# EasyEDA schematic SeniorDesignV2.json

## Sheets
1 LogicSch: TITLE: Logic; REV: 1.0; Date: 2020-09-24; Sheet: 1/1; Company: Owen Busler
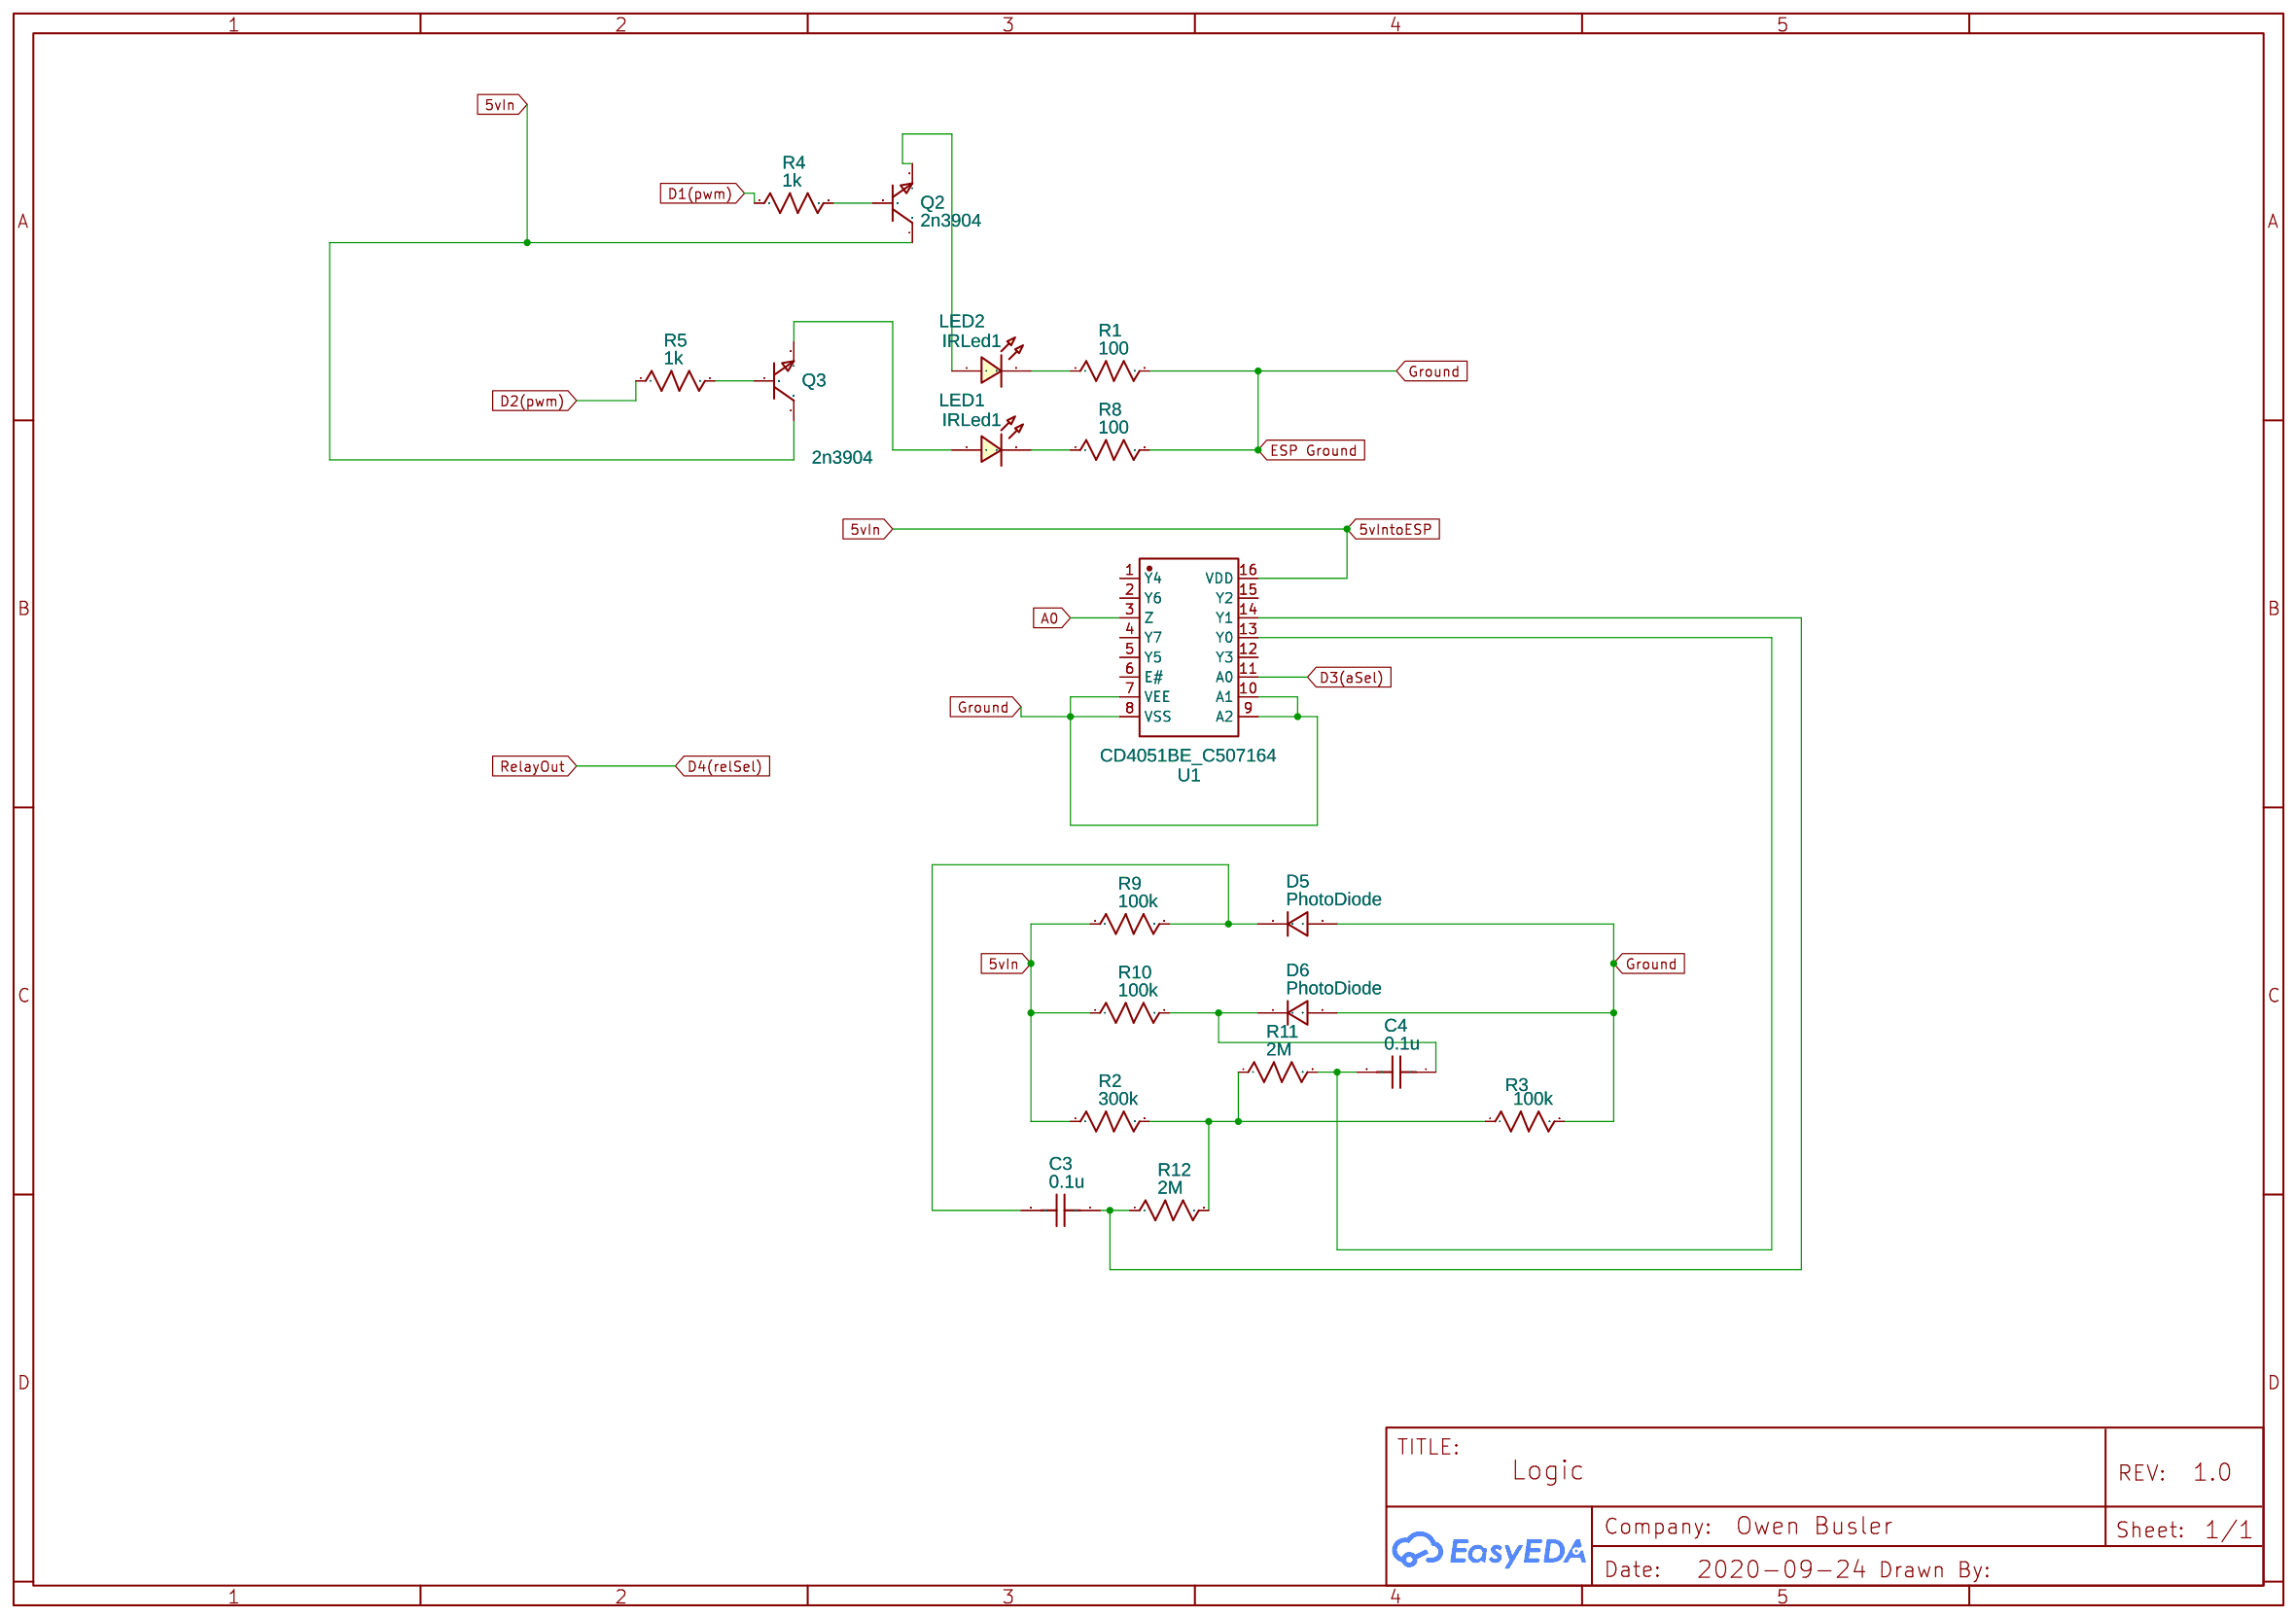
[diagram p0: LogicSch]
2 PowerSch: TITLE: PowerSch; Company: Your Company
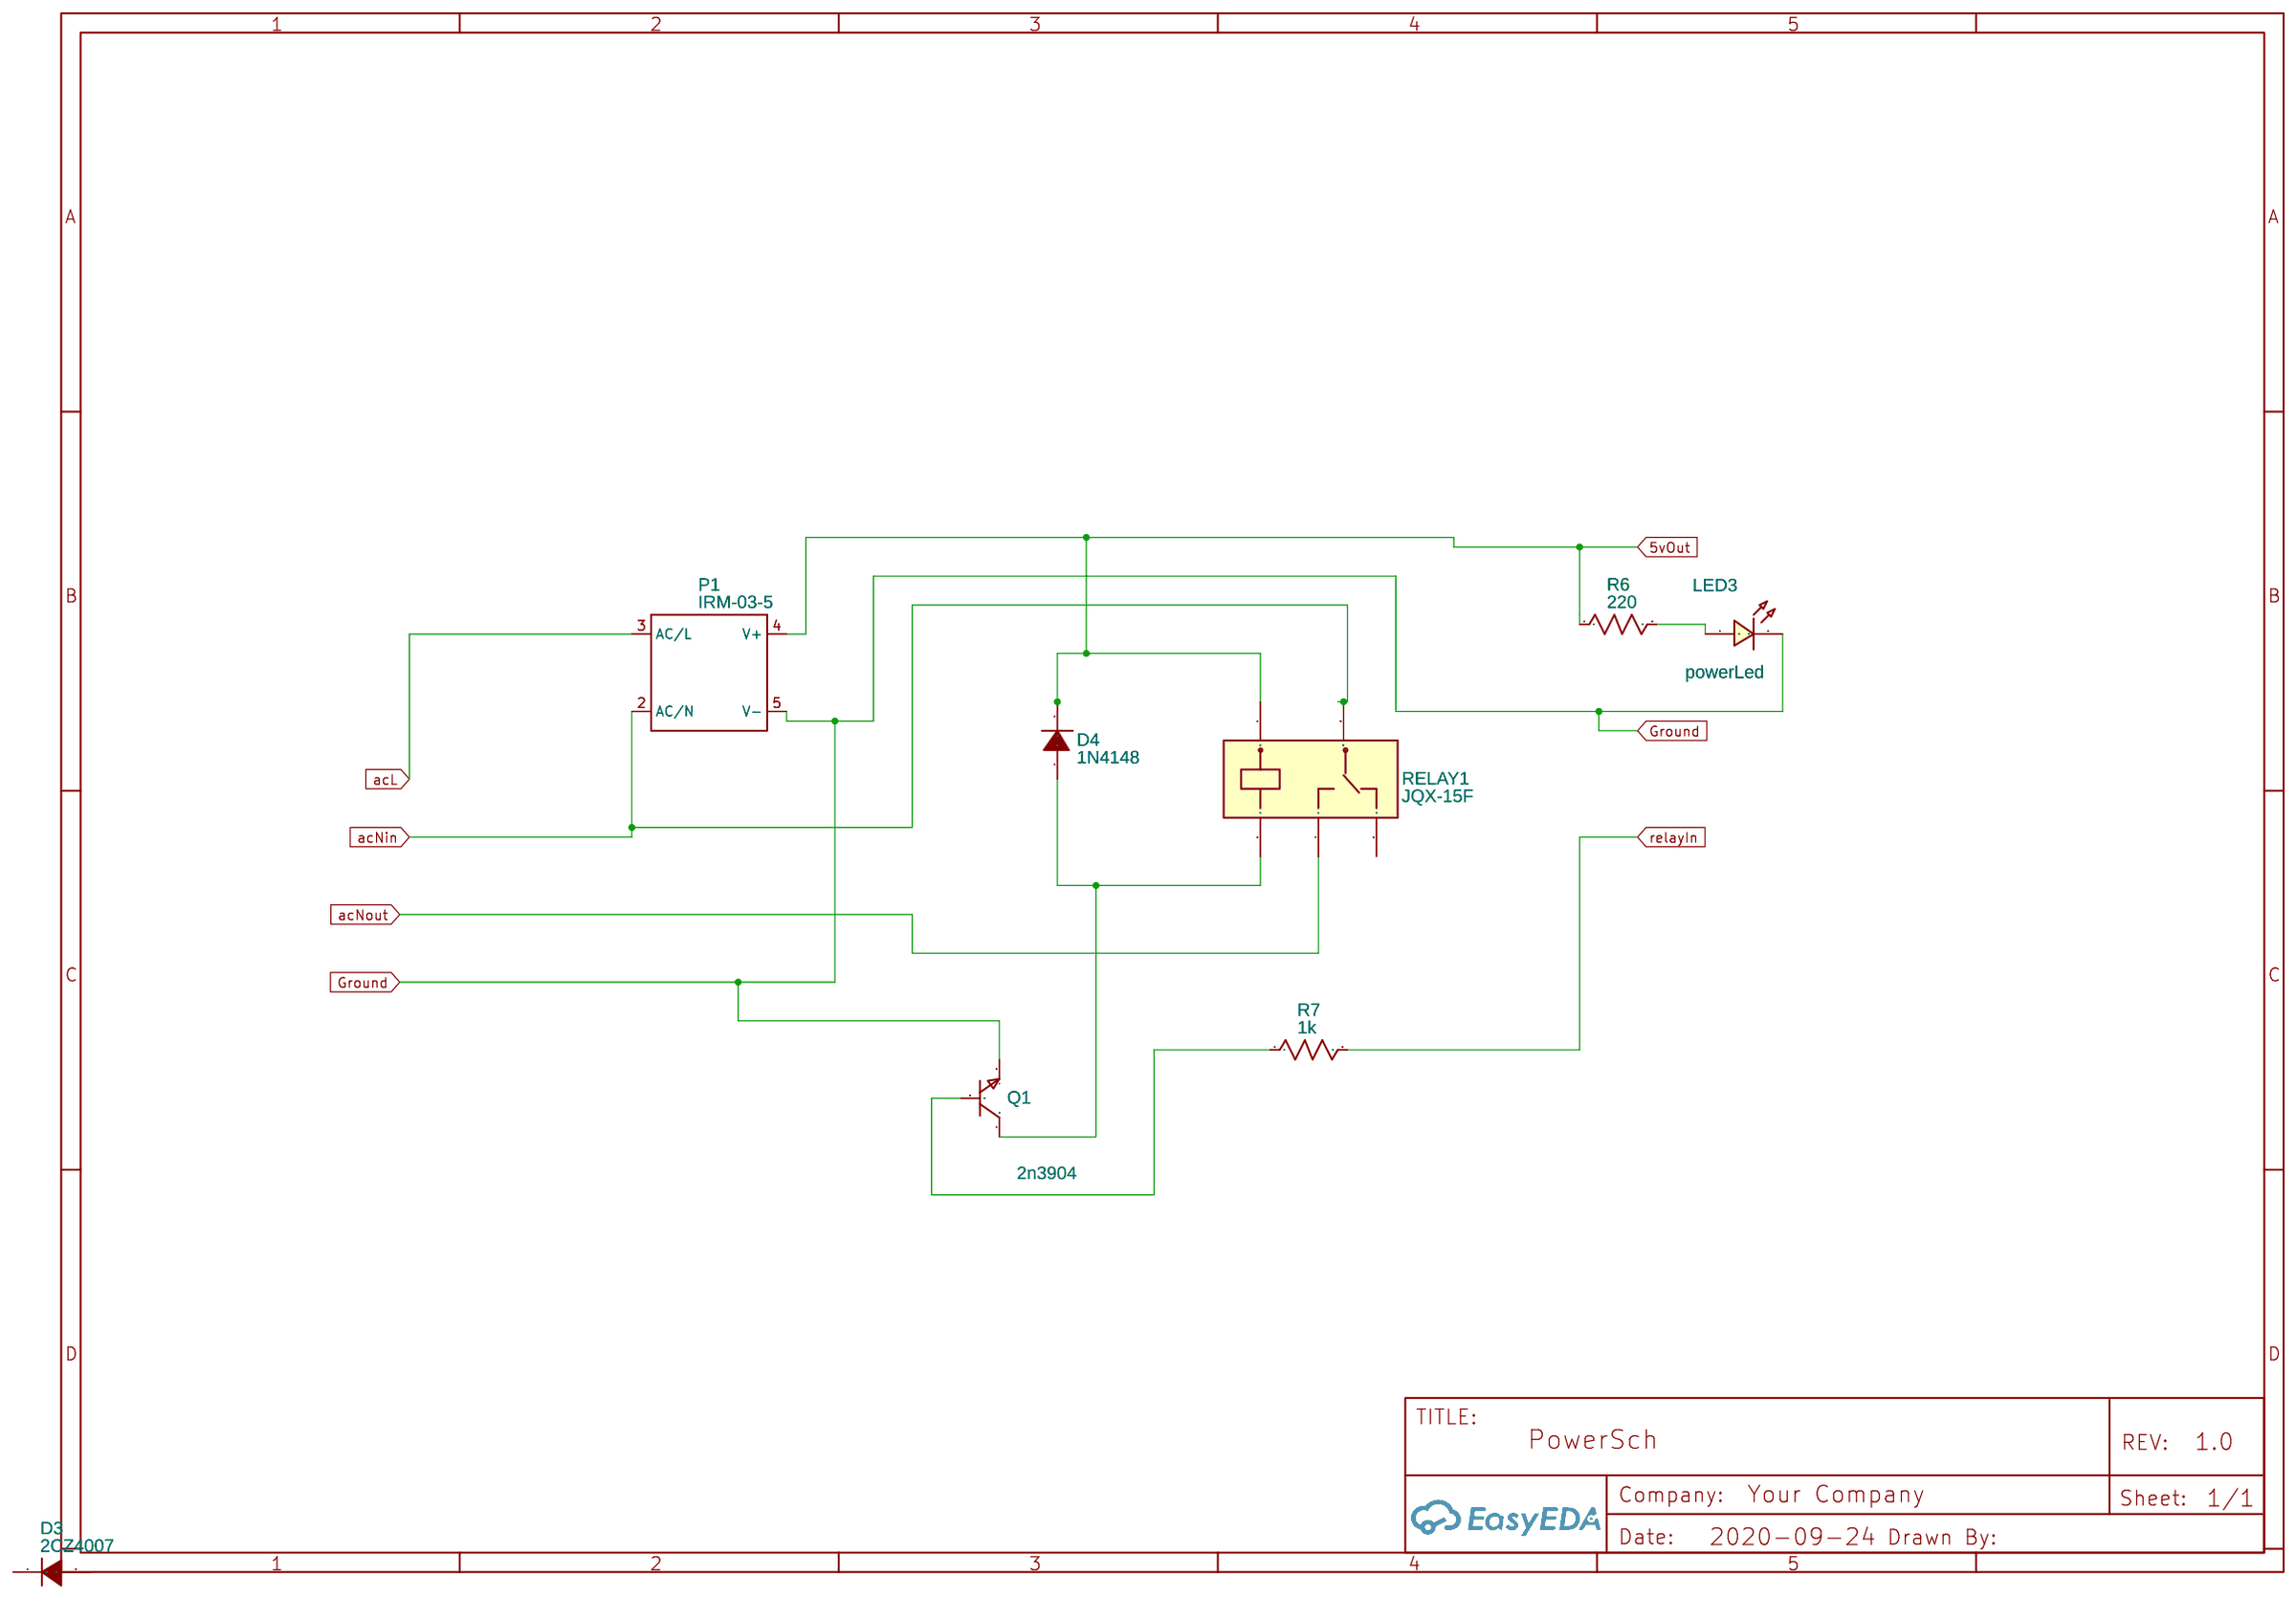
[diagram p1: PowerSch]

## Parts
sheet LogicSch
C3  0.1u  [C0603]
C4  0.1u  [C0603]
D5  PhotoDiode  [SOD-123_L2.8-W1.8-LS3.7-RD]
D6  PhotoDiode  [SOD-123_L2.8-W1.8-LS3.7-RD]
LED1  IRLed1  [LED0603_RED]
LED2  IRLed1  [LED0603_RED]
Q2  2n3904  [3904]
Q3  2n3904  [3904]
R1  100  [R0603]
R2  300k  [R0603]
R3  100k  [R0603]
R4  1k  [R0603]
R5  1k  [R0603]
R8  100  [R0603]
R9  100k  [R0603]
R10  100k  [R0603]
R11  2M  [R0603]
R12  2M  [R0603]
U1  CD4051BE_C507164  [DIP-16_L20.0-W6.4-P2.54-LS7.6-BL]
sheet PowerSch
D3  2CZ4007  [SOD-123_L2.7-W1.6-LS3.7-RD]
D4  1N4148  [DO-35_BD2.0-L4.0-P8.00-D0.5-FD]
LED3  powerLed  [LED0603_RED]
P1  IRM-03-5  [IRM-03-5V]
Q1  2n3904  [3904]
R6  220  [R0603]
R7  1k  [R0603]
RELAY1  JQX-15F  [JQX-15F SDPT RELAY]

## Library data of the parts
C3 C4 = C_0603_US: Contributor: LCEDA_Lib
D5 D6 = 1N4007W: Supplier: LCSC; Supplier Part: C328592; Manufacturer: BLUE ROCKET; Contributor: LCEDA_Lib
LED1-LED3 = LED-0603_R: Manufacturer: EVERLIGHT(台湾亿光); Manufacturer Part: 19-217/R6C-AL1M2VY/3T; Supplier Part: C72044; Supplier: LCSC; Contributor: LCEDA_01
Q1-Q3 = 2n3904: Contributor: mossriller; Package Display: No
R1-R12 = R_0603_US: Contributor: LCEDA_Lib
U1 = CD4051BE_C507164: Supplier: LCSC; Supplier Part: C507164; Manufacturer: HGSEMI; Manufacturer Part: CD4051BE; Contributor: LCSC
D3 = 2CZ4007: Supplier: LCSC; Manufacturer: CJ; Supplier Part: C85712; LCSC Assembly: Yes; SMT Type: Extend
D4 = 1N4148: Supplier: LCSC; Manufacturer: SEMTECH; image: //image.lceda.cn/szlcsc/C14516.jpg; Supplier Part: C14516
P1 = IRM-03-5: Contributor: cheguevara
RELAY1 = JQX-15F: Supplier Part: C3631; Supplier: LCSC; Manufacturer: HF; Manufacturer Part: JQX-105F-1/012D-1HS; image: //image.lceda.cn/szlcsc/C3631.jpg

## Nets
5vIn: Q2.1(C) Q3.1(C) R2.1 R9.1 R10.1 U1.16(VDD)
5vOut: D4.2(C) P1.4(V+) R6.1 RELAY1.1
A0: U1.3(Z)
acL: P1.3(AC/L)
acNin: P1.2(AC/N) RELAY1.5
acNout: RELAY1.4
D1(pwm): R4.1
D2(pwm): R5.1
D3(aSel): U1.11(A0)
ESP Ground: D5.2 D6.2 LED3.2 P1.5(V-) Q1.3(E) R1.2 R3.2 R8.2 U1.7(VEE) U1.8(VSS) U1.9(A2) U1.10(A1)
relayIn: R7.2
Net-(C3-1): C3.1 R12.1 U1.14(Y1)
Net-(C3-2): C3.2 D5.1 R9.2
Net-(C4-1): C4.1 D6.1 R10.2
Net-(C4-2): C4.2 R11.2 U1.13(Y0)
Net-(D4-1): D4.1(A) Q1.1(C) RELAY1.2
Net-(LED1-1): LED1.1 Q3.3(E)
Net-(LED1-2): LED1.2 R8.1
Net-(LED2-1): LED2.1 Q2.3(E)
Net-(LED2-2): LED2.2 R1.1
Net-(LED3-1): LED3.1 R6.2
Net-(Q1-2): Q1.2(B) R7.1
Net-(Q2-2): Q2.2(B) R4.2
Net-(Q3-2): Q3.2(B) R5.2
Net-(R2-2): R2.2 R3.1 R11.1 R12.2

Not connected (* = marked no-connect by the designer): D3 1(C) 2(A); RELAY1 3; U1 1(Y4) 2(Y6) 4(Y7) 5(Y5) 6(E#) 12(Y3) 15(Y2)
